# EAGLE schematic HR2M (EAGLE 7.6.0)
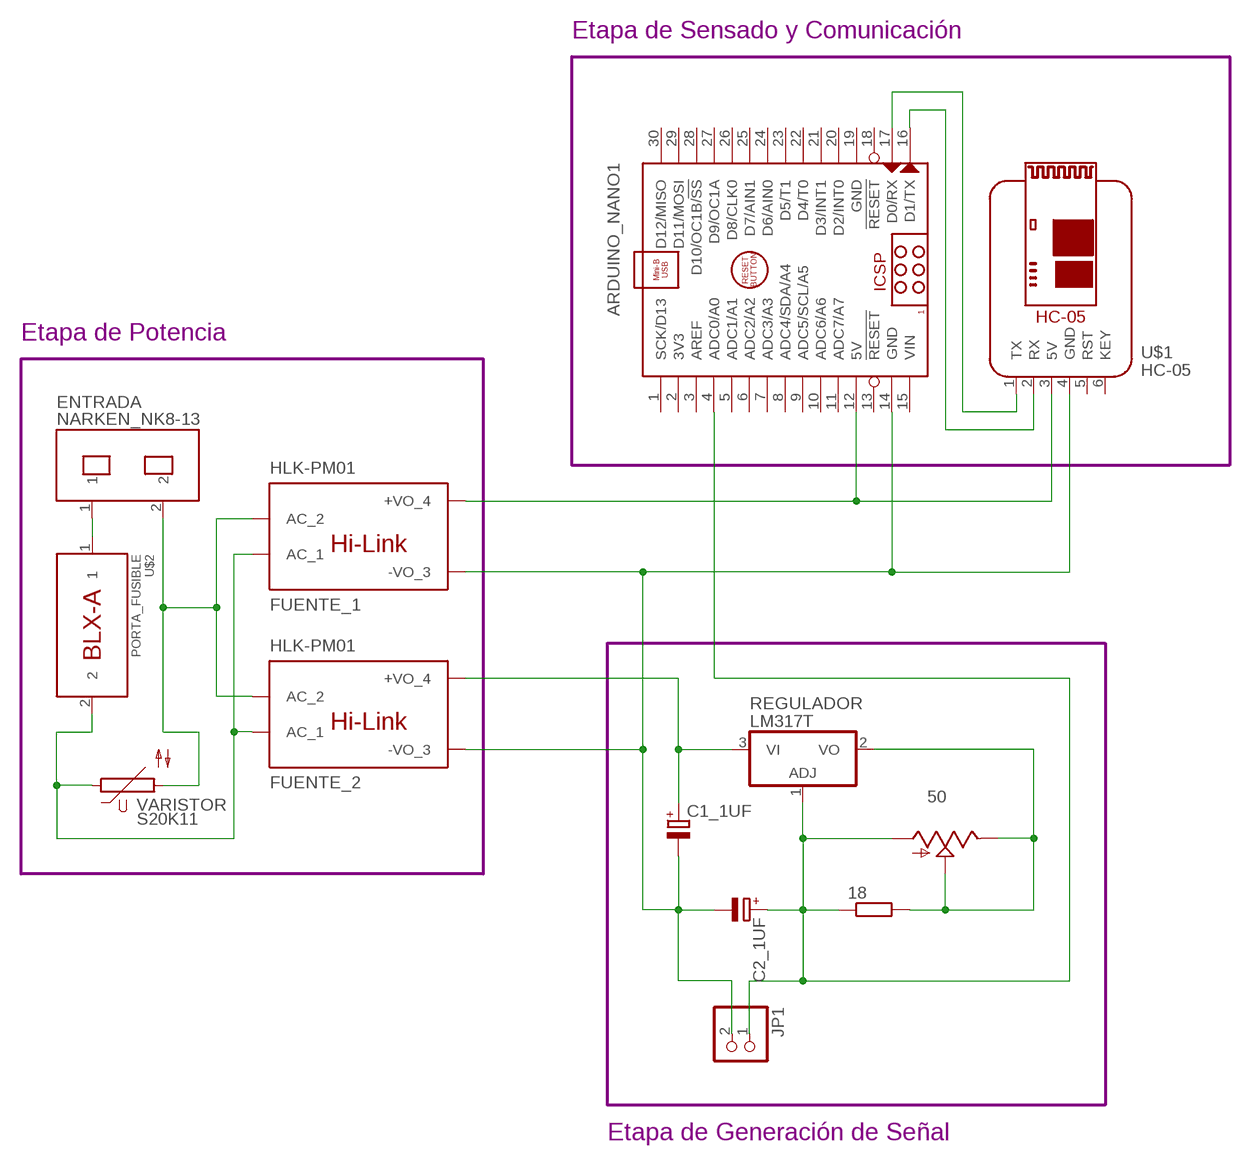
[diagram p0: schematic, sheet 1]

## Parts
18  R-EU_0207/12  [0207/12]
50  TRIM_US-B64Y  [B64Y]
ARDUINO_NANO1  ARDUINO_NANO  [ARDUINO_NANO]
C1_1UF  CPOL-EUE2.5-6  [E2,5-6]
C2_1UF  CPOL-EUE2.5-6  [E2,5-6]
ENTRADA  NARKEN_NK8-13  [NARKEN_NK8-13]
FUENTE_1  HLK-PM01  [HLK-PM01]
FUENTE_2  HLK-PM01  [HLK-PM01]
JP1  PINHD-1X2  [1X02]
REGULADOR  LM317T  [TO220V]
U$1  HC-05  [HC-0X_V]
U$2  PORTA_FUSIBLE  [PORTA_FUSIBLE]
VARISTOR  S20K11  [S20K11]

## Nets
GND: ARDUINO_NANO1.14(GND) C1_1UF.- C2_1UF.- FUENTE_1.-VO_3 FUENTE_2.-VO_3 JP1.2 U$1.4(GND)
N$1: ENTRADA.1 U$2.1
N$2: ARDUINO_NANO1.12(5V) FUENTE_1.+VO_4 U$1.3(5V)
N$3: ENTRADA.2 FUENTE_1.AC_2 FUENTE_2.AC_2 VARISTOR.2
N$4: ARDUINO_NANO1.17(D0/RX) U$1.1(TX)
N$5: FUENTE_1.AC_1 FUENTE_2.AC_1 U$2.2 VARISTOR.1
N$6: ARDUINO_NANO1.16(D1/TX) U$1.2(RX)
N$7: C1_1UF.+ FUENTE_2.+VO_4 REGULADOR.3(VI)
N$9: 18.1 50.A ARDUINO_NANO1.4(ADC0/A0) C2_1UF.+ JP1.1 REGULADOR.1(ADJ)
N$10: 18.2 50.E 50.S REGULADOR.2(VO)
Unconnected: ARDUINO_NANO1.1(SCK/D13) ARDUINO_NANO1.2(3V3) ARDUINO_NANO1.3(AREF) ARDUINO_NANO1.5(ADC1/A1) ARDUINO_NANO1.6(ADC2/A2) ARDUINO_NANO1.7(ADC3/A3) ARDUINO_NANO1.8(ADC4/SDA/A4) ARDUINO_NANO1.9(ADC5/SCL/A5) ARDUINO_NANO1.10(ADC6/A6) ARDUINO_NANO1.11(ADC7/A7) ARDUINO_NANO1.13(!RESET) ARDUINO_NANO1.18(!RESET) ARDUINO_NANO1.20(D2/INT0) ARDUINO_NANO1.21(D3/INT1) ARDUINO_NANO1.22(D4/T0) ARDUINO_NANO1.23(D5/T1) ARDUINO_NANO1.24(D6/AIN0) ARDUINO_NANO1.25(D7/AIN1) ARDUINO_NANO1.26(D8/CLK0) ARDUINO_NANO1.27(D9/OC1A) ARDUINO_NANO1.28(D10/OC1B/!SS) ARDUINO_NANO1.29(D11/MOSI) ARDUINO_NANO1.30(D12/MISO) U$1.5(RST) U$1.6(KEY)

## Notes on the sheet
- Etapa de Sensado y Comunicación
- Etapa de Potencia
- Etapa de Generación de Señal

## Power pins joined to a net without a drawn wire
GND: ARDUINO_NANO1.19(GND)
VIN: ARDUINO_NANO1.15(VIN)

## Library data of the parts
18 = resistor:R-EU_: RESISTOR, European symbol
50 = pot:TRIM_US-: POTENTIOMETER
ARDUINO_NANO1 = ArduinoNanoV30:ARDUINO_NANO: Arduino Nano V3.0 Module Overview: The Arduino Nano is a small, complete, and breadboard-friendly board based on the ATmega328 (Arduino Nano 3.x) or ATmega168 (Arduino Nano 2.x). It has more or less the same functionality of the Arduino Duemilanove, but in a different package. It lacks only a DC power jack, and works with a Mini-B USB cable instead of a standard one. The Nano was designed and is being produced by Gravitech <http://www.gravitech.us/arna30wiatp.html>. General specifications: Item Value Microcontroller Atmel ATmega168 or ATmega328 Operating Voltage (logic level) 5 V Input Voltage (recommended) 7-12 V Input Voltage (limits) 6-20 V Digital I/O Pins 14 (of which 6 provide PWM output) Analog Input Pins 8 DC Current per I/O Pin 40 mA Flash Memory 16 KB (ATmega168) or 32 KB (ATmega328) of which 2 KB used by bootloader SRAM 1 KB (ATmega168) or 2 KB (ATmega328) EEPROM 512 bytes (ATmega168) or 1 KB (ATmega328) Clock Speed 16 MHz Dimensions (Inches) 0.73" x 1.70" Dimensions (mm) 18mm x 45mm Overall height About 9 mm (not including pins) Weigth 5 g Power: The Arduino Nano can be powered via the Mini-B USB connection, 6-20V unregulated external power supply (pin 30), or 5V regulated external power supply (pin 27). The power source is automatically selected to the highest voltage source. Memory: The ATmega168 has 16 KB of flash memory for storing code (of which 2 KB is used for the bootloader); the ATmega328 has 32 KB, (also with 2 KB used for the bootloader). The ATmega168 has 1 KB of SRAM and 512 bytes of EEPROM (which can be read and written with the EEPROM library); the ATmega328 has 2 KB of SRAM and 1 KB of EEPROM. Input and Output: Each of the 14 digital pins on the Nano can be used as an input or output, using pinMode(), digitalWrite(), and digitalRead() functions. They operate at 5 volts. Each pin can provide or receive a maximum of 40 mA and has an internal pull-up resistor (disconnected by default) of 20-50 kOhms. In addition, some pins have specialized functions. Visit Arduino - ArduinoBoardNano <https://www.arduino.cc/en/Main/ArduinoBoardNano>
C1_1UF C2_1UF = resistor:CPOL-EU: POLARIZED CAPACITOR, European symbol
ENTRADA = personal:NARKEN_NK8-13: Conector AC Narken NK8-13 2.5A 250V; CURRENT: 2.5A; VOLTAGE: 250V
FUENTE_1 FUENTE_2 = personal:HLK-PM01: Fuente de alimentación AC-DC de 5V/ 0.6A, voltaje de entrada: 100 a 240VAC. Características: Potencia de salida: 3W. Ultra delgado y pequeño. Protección contra sobrecarga y cortocircuito.
JP1 = pinhead:PINHD-1X2: PIN HEADER
REGULADOR = personal:LM317T: 1.2V TO 37V VOLTAGE REGULATOR The LM317 are monolithic integrated circuit in TO-220, TO-220FP, TO-3 and D2PAK packages intended (in this case TO-220) for use as positive adjustable voltage regulators. They are designed to supply more than 1.5A of load current with an output voltage adjustable over a 1.2 to 37V range. The nominal output voltage is selected by means of only a resistive divider, making the device exceptionally easy to use and eliminating the stocking of many fixed regulators.
U$1 = personal:HC-05: Modulo Bluetooth HC-05
U$2 = personal:PORTA_FUSIBLE: Porta fusibletipo bornera para fusible de 20mm de largo.
VARISTOR = varistor:S20K11: VARISTOR

## Net classes
0 default: clearance 0.205 mm